# Altium schematic sheet Three Phase Inverter Based on IR2111 Gate Driver.SchDoc
size B
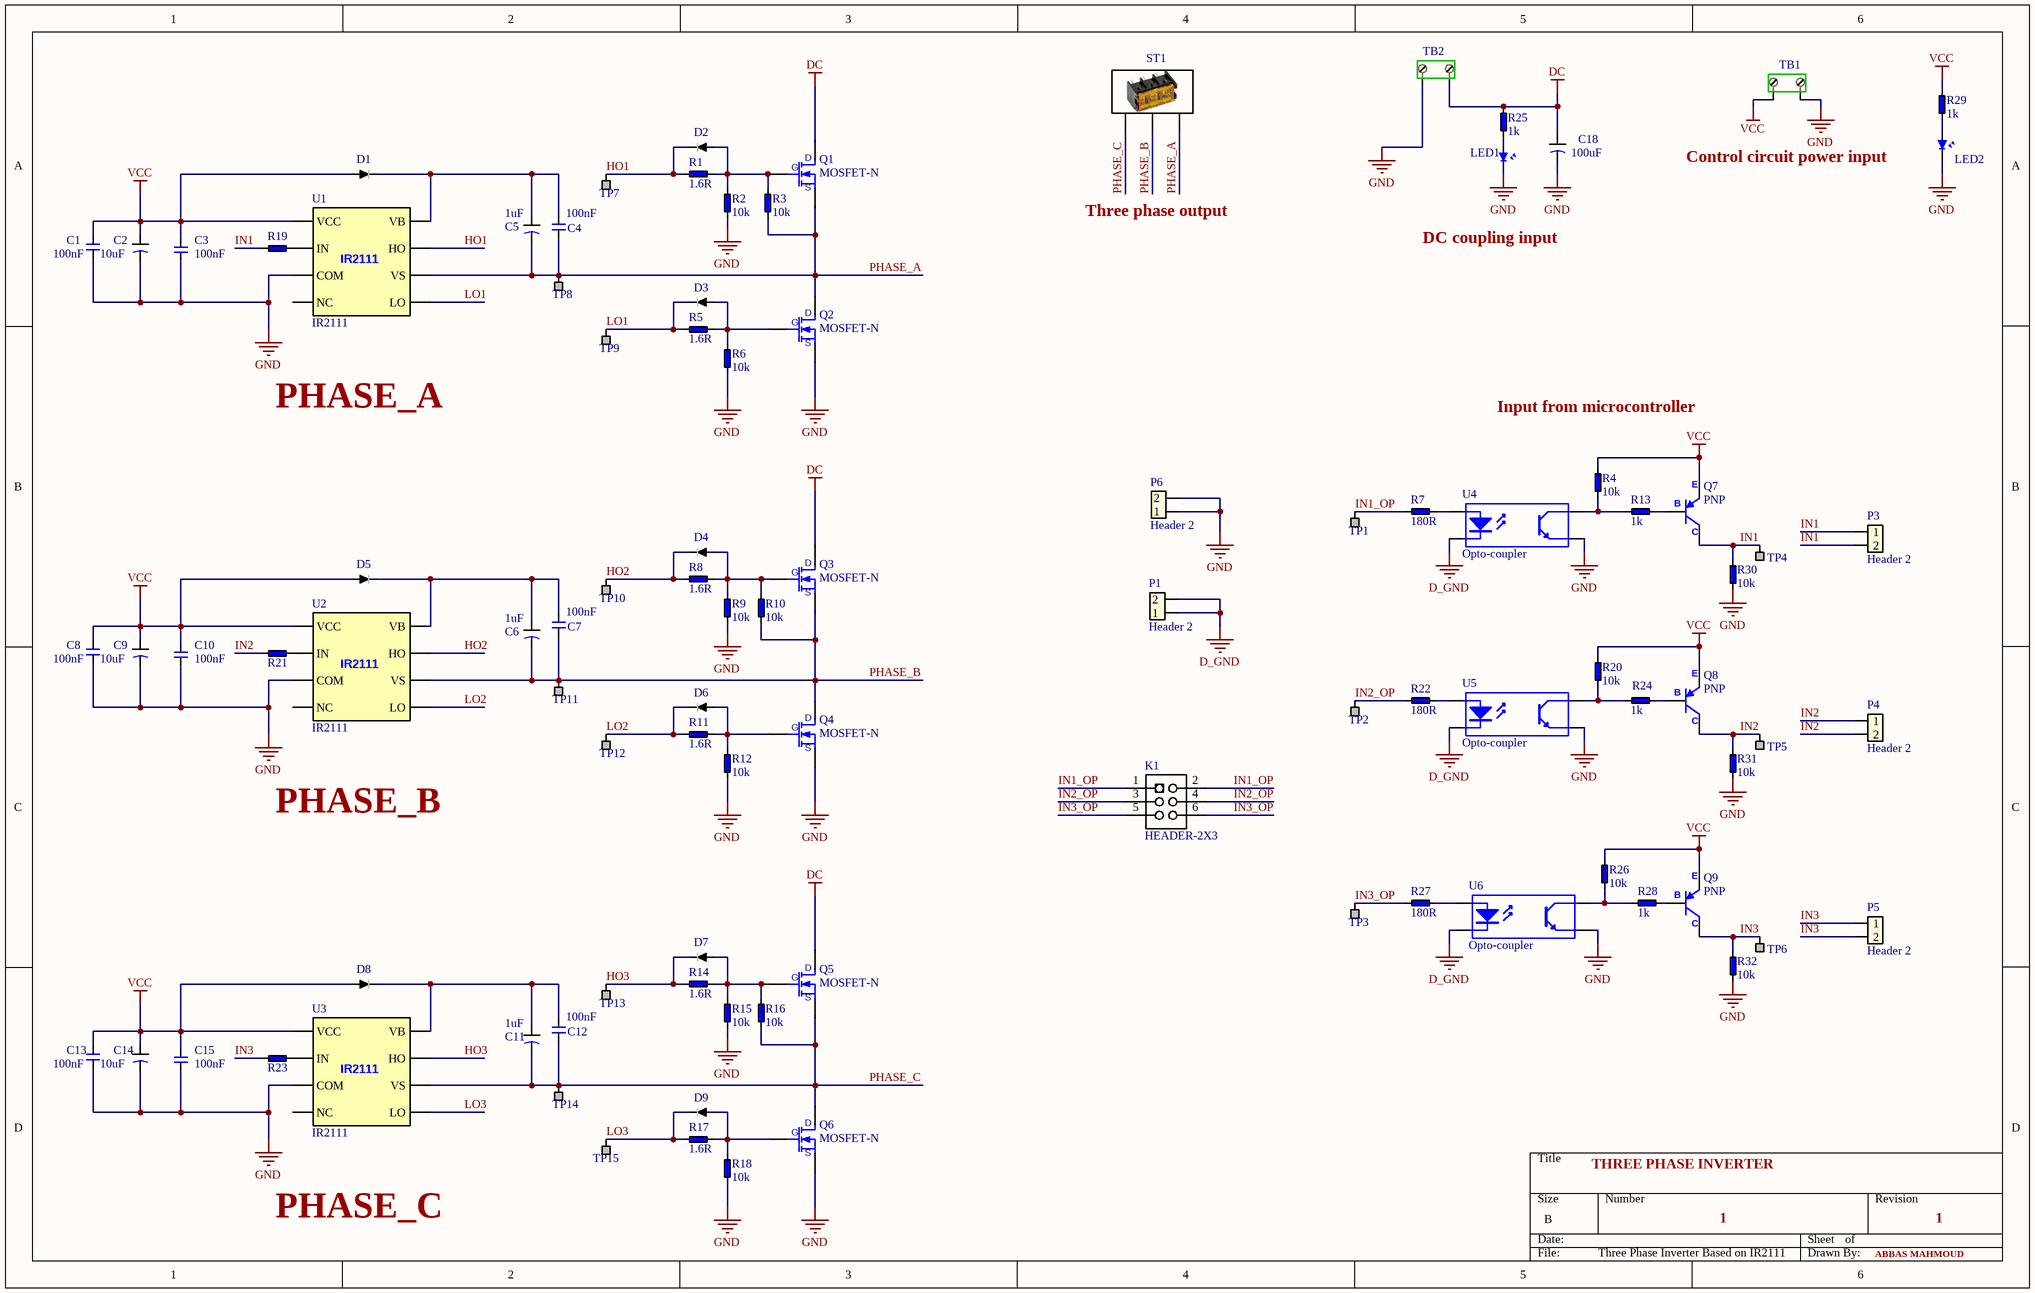
[diagram p0: Three Phase Inverter Based on IR2111 Gate Driver.SchDoc]

## Parts
C1  100nF  [CCAP 0.1 P Y]
C2  10uF  [ECAP 5X11X2MM]
C3  100nF  [CCAP 0.1 P Y]
C4  100nF  [CCAP 0.1 P Y]
C5  1uF  [ECAP 5X11X2MM]
C6  1uF  [ECAP 5X11X2MM]
C7  100nF  [CCAP 0.1 P Y]
C8  100nF  [CCAP 0.1 P Y]
C9  10uF  [ECAP 5X11X2MM]
C10  100nF  [CCAP 0.1 P Y]
C11  1uF  [ECAP 5X11X2MM]
C12  100nF  [CCAP 0.1 P Y]
C13  100nF  [CCAP 0.1 P Y]
C14  10uF  [ECAP 5X11X2MM]
C15  100nF  [CCAP 0.1 P Y]
C18  100uF  [ECAP 10X20X5MM]
D1  DIODE  [DIODE-1n400X_0.3]  (value not drawn)
D2  DIODE  [DIODE-1n400X_0.3]  (value not drawn)
D3  DIODE  [DIODE-1n400X_0.3]  (value not drawn)
D4  DIODE  [DIODE-1n400X_0.3]  (value not drawn)
D5  DIODE  [DIODE-1n400X_0.3]  (value not drawn)
D6  DIODE  [DIODE-1n400X_0.3]  (value not drawn)
D7  DIODE  [DIODE-1n400X_0.3]  (value not drawn)
D8  DIODE  [DIODE-1n400X_0.3]  (value not drawn)
D9  DIODE  [DIODE-1n400X_0.3]  (value not drawn)
K1  HEADER-2X3  [HEADER-2X3]
LED1  LED  [LED 3MM RED]  (value not drawn)
LED2  LED  [LED 5MM WHITE]  (value not drawn)
P1  Header 2  [PINHEADER X2]
P3  Header 2  [PINHEADER X2]
P4  Header 2  [PINHEADER X2]
P5  Header 2  [PINHEADER X2]
P6  Header 2  [PINHEADER X2]
Q1  MOSFET-N  [Transistor-Mosfet_N_power]
Q2  MOSFET-N  [Transistor-Mosfet_N_power]
Q3  MOSFET-N  [Transistor-Mosfet_N_power]
Q4  MOSFET-N  [Transistor-Mosfet_N_power]
Q5  MOSFET-N  [Transistor-Mosfet_N_power]
Q6  MOSFET-N  [Transistor-Mosfet_N_power]
Q7  PNP  [Transistor - duplicate3]
Q8  PNP  [Transistor - duplicate3]
Q9  PNP  [Transistor - duplicate3]
R1  1.6R  [RESISTOR _1]
R2  10k  [RESISTOR _1]
R3  10k  [RESISTOR _1]
R4  10k  [RESISTOR _1]
R5  1.6R  [RESISTOR _1]
R6  10k  [RESISTOR _1]
R7  180R  [RESISTOR _1]
R8  1.6R  [RESISTOR _1]
R9  10k  [RESISTOR _1]
R10  10k  [RESISTOR _1]
R11  1.6R  [RESISTOR _1]
R12  10k  [RESISTOR _1]
R13  1k  [RESISTOR _1]
R14  1.6R  [RESISTOR _1]
R15  10k  [RESISTOR _1]
R16  10k  [RESISTOR _1]
R17  1.6R  [RESISTOR _1]
R18  10k  [RESISTOR _1]
R19  1k  [RESISTOR _1]  (value not drawn)
R20  10k  [RESISTOR _1]
R21  1k  [RESISTOR _1]  (value not drawn)
R22  180R  [RESISTOR _1]
R23  1k  [RESISTOR _1]  (value not drawn)
R24  1k  [RESISTOR _1]
R25  1k  [RESISTOR _9]
R26  10k  [RESISTOR _1]
R27  180R  [RESISTOR _1]
R28  1k  [RESISTOR _1]
R29  1k  [RESISTOR _9]
R30  10k  [RESISTOR _1]
R31  10k  [RESISTOR _1]
R32  10k  [RESISTOR _1]
ST1  SCREW TERMINAL x3  [SCREW TERMINAL  x3]  (value not drawn)
TB1  Terminal block 2 pin  [AK500/2 - pluggable]  (value not drawn)
TB2  Terminal block 2 pin  [AK500/2 - pluggable]  (value not drawn)
TP1  TESTPIN  [TESTPIN]  (value not drawn)
TP2  TESTPIN  [TESTPIN]  (value not drawn)
TP3  TESTPIN  [TESTPIN]  (value not drawn)
TP4  TESTPIN  [TESTPIN]  (value not drawn)
TP5  TESTPIN  [TESTPIN]  (value not drawn)
TP6  TESTPIN  [TESTPIN]  (value not drawn)
TP7  TESTPIN  [TESTPIN]  (value not drawn)
TP8  TESTPIN  [TESTPIN]  (value not drawn)
TP9  TESTPIN  [TESTPIN]  (value not drawn)
TP10  TESTPIN  [TESTPIN]  (value not drawn)
TP11  TESTPIN  [TESTPIN]  (value not drawn)
TP12  TESTPIN  [TESTPIN]  (value not drawn)
TP13  TESTPIN  [TESTPIN]  (value not drawn)
TP14  TESTPIN  [TESTPIN]  (value not drawn)
TP15  TESTPIN  [TESTPIN]  (value not drawn)
U1  IR2111  [IC X8 PIN]
U2  IR2111  [IC X8 PIN]
U3  IR2111  [IC X8 PIN]
U4  Opto-coupler  [IC X4 PIN]
U5  Opto-coupler  [IC X4 PIN]
U6  Opto-coupler  [IC X4 PIN]

## Nets
D_GND: P1.1 P1.2 U4.2(K) U5.2(K) U6.2(K)
DC: C18.A Q1.2(D) Q3.2(D) Q5.2(D) R25.2 TB2.1
GND: C1.2 C2.K C3.2 C8.2 C9.K C10.2 C13.2 C14.K C15.2 C18.K LED1.K LED2.K P6.1 P6.2 Q2.3(S) Q4.3(S) Q6.3(S) R2.1 R6.1 R9.1 R12.1 R15.1 R18.1 R30.2 R31.2 R32.2 TB1.1 TB2.2 U1.3(COM) U2.3(COM) U3.3(COM) U4.3(E) U5.3(E) U6.3(E)
VCC: C1.1 C2.A C3.1 C8.1 C9.A C10.1 C13.1 C14.A C15.1 D1.A D5.A D8.A Q7.1(E) Q8.1(E) Q9.1(E) R4.2 R20.2 R26.2 R29.2 TB1.2 U1.1(VCC) U2.1(VCC) U3.1(VCC)
HO1: D2.K R1.1 TP7.1 U1.7(HO)
HO2: D4.K R8.1 TP10.1 U2.7(HO)
HO3: D7.K R14.1 TP13.1 U3.7(HO)
IN1: P3.1 P3.2 Q7.3(C) R19.1 R30.1 TP4.1
IN1_OP: K1.1 K1.2 R7.1 TP1.1
IN2: P4.1 P4.2 Q8.3(C) R21.1 R31.1 TP5.1
IN2_OP: K1.3 K1.4 R22.1 TP2.1
IN3: P5.1 P5.2 Q9.3(C) R23.1 R32.1 TP6.1
IN3_OP: K1.5 K1.6 R27.1 TP3.1
LO1: D3.K R5.1 TP9.1 U1.4(LO)
LO2: D6.K R11.1 TP12.1 U2.4(LO)
LO3: D9.K R17.1 TP15.1 U3.4(LO)
PHASE_A: C4.2 C5.K Q1.3(S) Q2.2(D) R3.1 ST1.3 TP8.1 U1.6(VS)
PHASE_B: C6.K C7.2 Q3.3(S) Q4.2(D) R10.1 ST1.2 TP11.1 U2.6(VS)
PHASE_C: C11.K C12.2 Q5.3(S) Q6.2(D) R16.1 ST1.1 TP14.1 U3.6(VS)
NetC4_1: C4.1 C5.A D1.K U1.8(VB)
NetC6_A: C6.A C7.1 D5.K U2.8(VB)
NetC11_A: C11.A C12.1 D8.K U3.8(VB)
NetD2_A: D2.A Q1.1(G) R1.2 R2.2 R3.2
NetD3_A: D3.A Q2.1(G) R5.2 R6.2
NetD4_A: D4.A Q3.1(G) R8.2 R9.2 R10.2
NetD6_A: D6.A Q4.1(G) R11.2 R12.2
NetD7_A: D7.A Q5.1(G) R14.2 R15.2 R16.2
NetD9_A: D9.A Q6.1(G) R17.2 R18.2
NetLED1_A: LED1.A R25.1
NetLED2_A: LED2.A R29.1
NetQ7_2: Q7.2(B) R13.2
NetQ8_2: Q8.2(B) R24.2
NetQ9_2: Q9.2(B) R28.2
NetR4_1: R4.1 R13.1 U4.4(C)
NetR7_2: R7.2 U4.1(A)
NetR19_2: R19.2 U1.2(IN)
NetR20_1: R20.1 R24.1 U5.4(C)
NetR21_2: R21.2 U2.2(IN)
NetR22_2: R22.2 U5.1(A)
NetR23_2: R23.2 U3.2(IN)
NetR26_1: R26.1 R28.1 U6.4(C)
NetR27_2: R27.2 U6.1(A)

Not connected (* = marked no-connect by the designer): U1 5(NC); U2 5(NC); U3 5(NC)

## Notes on the sheet
- Control circuit power input
- Three phase output
- DC coupling input
- PHASE_A
- Input from microcontroller
- PHASE_B
- THREE PHASE INVERTER
- PHASE_C
- 1
- ABBAS MAHMOUD

## Library data of the parts
C1 C3 C4 C7 C8 C10 C12 C13 C15 = CERAMIC CAP
C2 C5 C6 C9 C11 C14 C18 = CAP POL
P1 P3-P6 = Header 2: Header, 2-Pin; LatestRevisionDate: 17-Jul-2002; LatestRevisionNote: Re-released for DXP Platform.; Publisher: Altium Limited
Q1-Q6 = MOSFET-N: N CHANNEL MOSFET
R1-R32 = RESISTOR
ST1 = SCREW TERMINAL x3: Barrier Terminal Block 3 Pin with cover 300V/25A
TB1 TB2 = Terminal block 2 pin: Terminal Block 2 Pin 10A 300V
TP1-TP15 = TESTPIN: TESTPIN SINGLE PIN HEADER; Manufacturer 1: Sharon Long Industries; Manufacturer Part Number 1: Cut-it-yourself; Reel: TH; Supplier 1: Sharon Long Industries; Supplier 1 Part number: Cut-It-Yourself
U1-U3 = IR2111: HALF-BRIDGE DRIVER
U4-U6 = Opto-coupler: 4-Pin Phototransistor Optocoupler; Published: 24-Mar-1999; LatestRevisionDate: 04-Mar-2005; LatestRevisionNote: Sch pins 3 & 4 Swapped.; DatasheetVersion: Nov-2003; PackageReference: DIP-4; Publisher: Altium Limited